# Altium schematic sheet EEPROM and Temperature Sensor.SchDoc
size A4
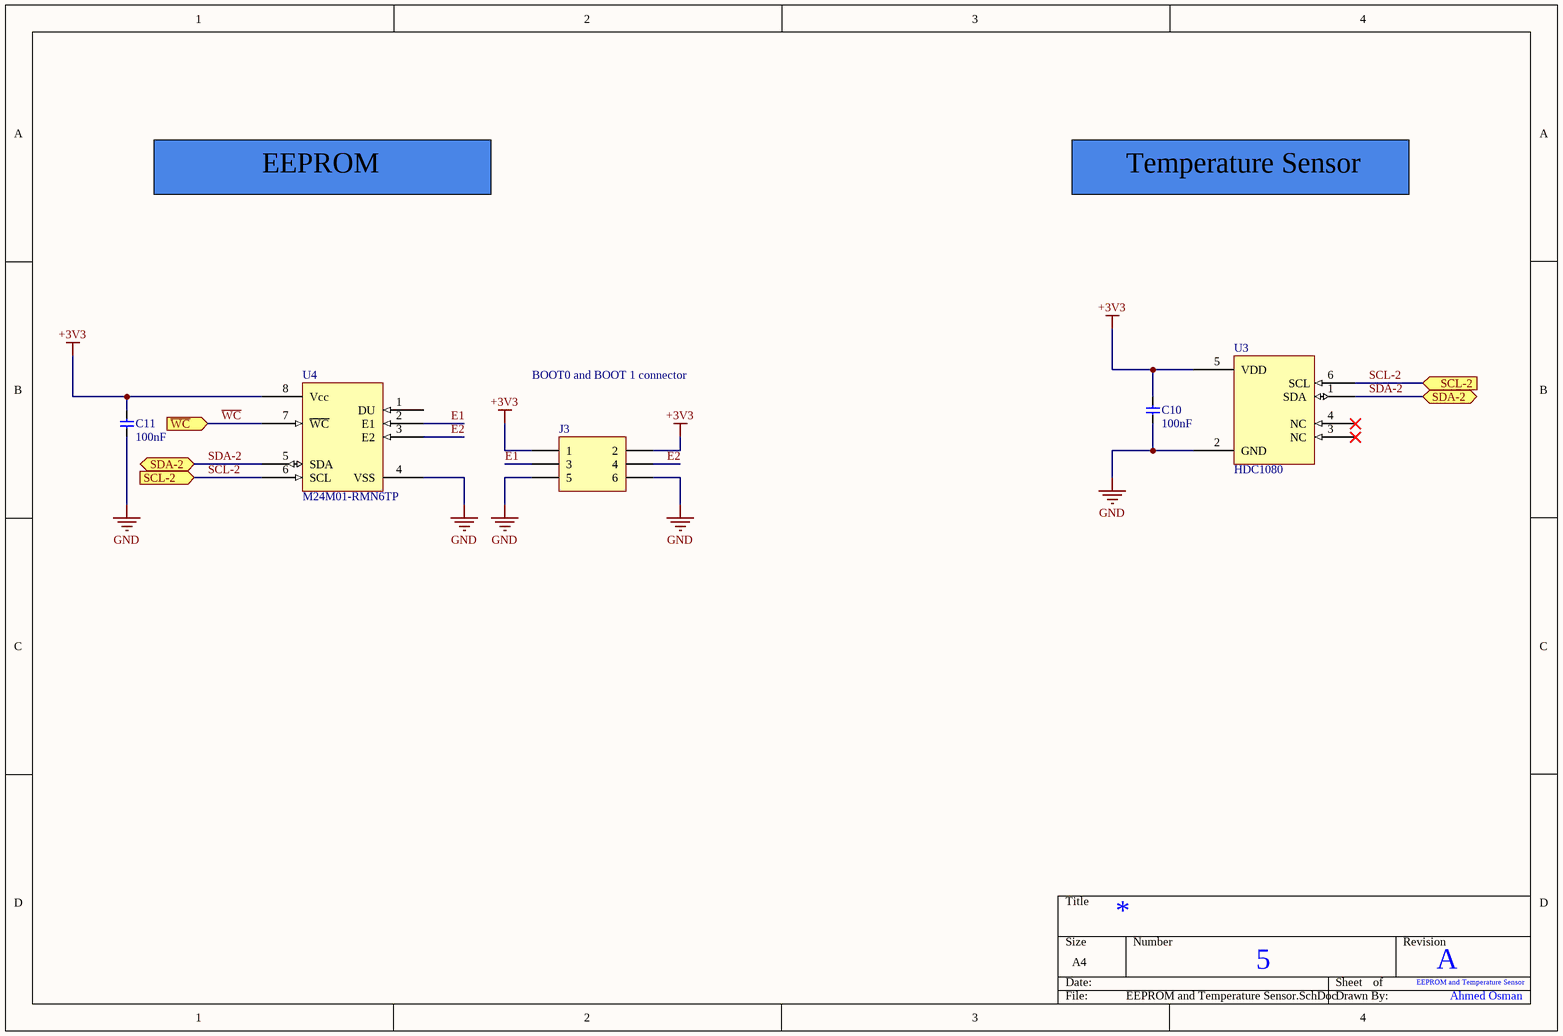
[diagram p0: EEPROM and Temperature Sensor.SchDoc]

## Parts
C10  100nF  [CAP 0603]
C11  100nF  [CAP 0603]
J3  BOOT0 and BOOT 1 connector  [2X3 Female Pin Header Connector]
U3  HDC1080  [PWSON(6-pin) DMB]
U4  M24M01-RMN6TP  [SO8N]

## Ports
SCL-2 (in), SDA-2 (bidir), ~{WC} (in)

## Nets
+3V3: C10.2 C11.1 J3.1 J3.2 U3.5(VDD) U4.8(Vcc)
GND: C10.1 C11.2 J3.5 J3.6 U3.2(GND) U4.4(VSS)
E1: J3.3 U4.2(E1)
E2: J3.4 U4.3(E2)
SCL-2: U3.6(SCL) U4.6(SCL) ; port SCL-2
SDA-2: U3.1(SDA) U4.5(SDA) ; port SDA-2
~{WC}: U4.7(~{WC}) ; port ~{WC}

Not connected (* = marked no-connect by the designer): U3 3(NC)* 4(NC)*; U4 1(DU)

## Notes on the sheet
- EEPROM
- Temperature Sensor
- 5
- EEPROM and Temperature Sensor
- A
- Ahmed Osman

## Library data of the parts
C10 C11 = CAP  0603 100nF 10% 50 V: 0.1 µF ±10% 50V Ceramic Capacitor X7R 0603 (1608 Metric); Manufacturer 1: Samsung; Manufacturer Part Number 1: CL10B104KB8NNNC; Supplier 1: Digikey; Stock 1: 6418947; Pricing 1: 4000 = 0.00562, 8000 = 0.00513, 12000 = 0.00489, 28000 = 0.00464, 100000 = 0.00336, 200000 = 0.00325, 400000 = 0.00306 (USD); RoHS: Yes; Mount: Surface Mount; Case/Package: 0603; Case Code (Metric): 1608; Case Code (Imperial): 0603; Material: Ceramic; Min Operating Temperature: -55°C; Max Operating Temperature: 125°C; Capacitance: 100nF; Tolerance: 10%; Dielectric: X7R; Voltage: 50V; Voltage Rating (DC): 50V; Voltage Rating: 50V; Package Quantity: 1; Packaging: Tape and Reel; Series: CL; Construction: Flat; Length: 1.6mm; Width: 0.031inch; Height: 0.8mm; Depth: 0.8mm; Thickness: 0.035inch; Radiation Hardening: No; Lead Free: Lead Free; RoHS Compliant: Yes; ComponentLink1URL: https://datasheet.ciiva.com/25803/cl10b104kb8nnnc-25803393.pdf?src-supplier=Digikey; ComponentLink1Description: https://datasheet.ciiva.com/25803/cl10b104kb8nnnc-25803393.pdf?src-supplier=Digikey; ComponentLink2URL: https://datasheet.ciiva.com/26838/getdatasheetpartid-89097-26838411.pdf?src-supplier=Verical; ComponentLink2Description: https://datasheet.ciiva.com/26838/getdatasheetpartid-89097-26838411.pdf?src-supplier=Verical; ComponentLink3URL: https://datasheet.ciiva.com/29198/456651-da-01-en-vs-kondensator-0605-29198839.pdf?src-supplier=Conrad; ComponentLink3Description: https://datasheet.ciiva.com/29198/456651-da-01-en-vs-kondensator-0605-29198839.pdf?src-supplier=Conrad; Supplier Part Number 1: 1276-1000-2-ND; value: 100nF; Manufacturer 2: Samsung; Manufacturer Part Number 2: CL10B104KB8NNNC; Supplier 2: LCSC; Supplier Part Number 2: C1591
J3 = BOOT0 and BOOT 1 connector: 2.54mm 2.54mm Double Row 2.5A 6P -40℃~+105℃ Direct Insert 2x3P Top 8.5mm Square Hole Plugin,P=2.54mm Female Headers ROHS; Supplier 2: LCSC; Supplier Part Number 2: C5116527; Manufacturer 2: ZHOURI; Manufacturer Part Number 2: PM2.54-2*3
U3 = HDC1080: Humidity, Temperature 0 ~ 100% RH I2C ±2% RH 15 s Surface Mount; Response Time: 15s; Supplier 1: Digikey; Stock 1: 6270; Pricing 1: 1 = 3.47, 5 = 2.928, 10 = 2.721, 25 = 2.4688, 50 = 2.2942, 100 = 2.1319, 500 = 1.79838, 1000 = 1.67143 (USD); RoHS: Yes; Mount: Surface Mount; Min Operating Temperature: -40°C; Max Operating Temperature: 125°C; Accuracy: 2%; Interface: I2C; Sensor Type: Temperature; Output Type: I2C; Series: -; Packaging: Cut Tape; Lead Free: Lead Free; RoHS Compliant: Yes; ComponentLink1URL: http://www.ti.com/lit/ds/symlink/hdc1080.pdf?src-supplier=Digikey; ComponentLink1Description: http://www.ti.com/lit/ds/symlink/hdc1080.pdf?src-supplier=Digikey; ComponentLink2URL: http://www.ti.com/general/docs/suppproductinfo.tsp?distId=10&amp;gotoUrl=http%3A%2F%2Fwww.ti.com%2Flit%2Fgpn%2Fhdc1080&src-supplier=Digikey; ComponentLink2Description: http://www.ti.com/general/docs/suppproductinfo.tsp?distId=10&amp;gotoUrl=http%3A%2F%2Fwww.ti.com%2Flit%2Fgpn%2Fhdc1080&src-supplier=Digikey; Supplier 2: LCSC; Supplier Part Number 2: C82227; Supplier Part Number 1: 296-46272-1-ND; Manufacturer 2: Texas Instruments; Manufacturer Part Number 2: HDC1080DMBR
U4 = M24M01-RMN6TP: EEPROM Memory IC 1Mbit I2C 1 MHz 500 ns 8-SOIC; Organization: 32KX8; Interface: I2C,Serial; Access Time: 500ns; Density: 1Mb; Max Frequency: 400kHz; Max Supply Voltage: 5.5V; Min Supply Voltage: 1.8V; Frequency: 1MHz; Operating Supply Voltage: 5V; Memory Type: Non-Volatile,EEPROM; Write Cycle Time-Max (tWC): 5ms; Access Time-Max: 900ns; Write Protection: YES; Supply Current: 2mA; Supplier 1: Digikey; Stock 1: 11953; Pricing 1: 1 = 1.41, 10 = 1.287, 25 = 1.252, 50 = 1.2456, 100 = 1.1134, 250 = 1.11012, 500 = 1.09336, 1000 = 1.04695 (USD); RoHS: Yes; Mount: Surface Mount; Case/Package: SOIC; Number of Pins: 8; Min Operating Temperature: -40°C; Max Operating Temperature: 85°C; Packaging: Tape and Reel; Package Quantity: 2500; Memory Size: 1Mb; Series: -; Supply Voltage-Nom: 5.5V; Programming Voltage: 5.5V; Length: 5mm; Width: 4mm; Height: 1.25mm; Radiation Hardening: No; Lead Free: Lead Free; RoHS Compliant: Yes; ComponentLink1URL: https://datasheet.ciiva.com/1905/cd00147128-1905279.pdf?src-supplier=Digikey; ComponentLink1Description: https://datasheet.ciiva.com/1905/cd00147128-1905279.pdf?src-supplier=Digikey; ComponentLink2URL: https://datasheet.ciiva.com/1905/cd00147128-1905280.pdf?src-supplier=Digikey; ComponentLink2Description: https://datasheet.ciiva.com/1905/cd00147128-1905280.pdf?src-supplier=Digikey; ComponentLink3URL: https://datasheet.ciiva.com/1905/cd00147128-1905281.pdf?src-supplier=Digikey; ComponentLink3Description: https://datasheet.ciiva.com/1905/cd00147128-1905281.pdf?src-supplier=Digikey; ComponentLink4URL: https://datasheet.ciiva.com/41455/001185587-da-01-en-ic-eeprom-1mbit-m24m01-rmn6tp-soic-8-stm-41455205.pdf?src-supplier=Conrad; ComponentLink4Description: https://datasheet.ciiva.com/41455/001185587-da-01-en-ic-eeprom-1mbit-m24m01-rmn6tp-soic-8-stm-41455205.pdf?src-supplier=Conrad; Supplier 2: LCSC; Supplier Part Number 2: C79990; Supplier Part Number 1: 497-6351-1-ND; Manufacturer 2: STMicroelectronics; Manufacturer Part Number 2: M24M01-RMN6TP